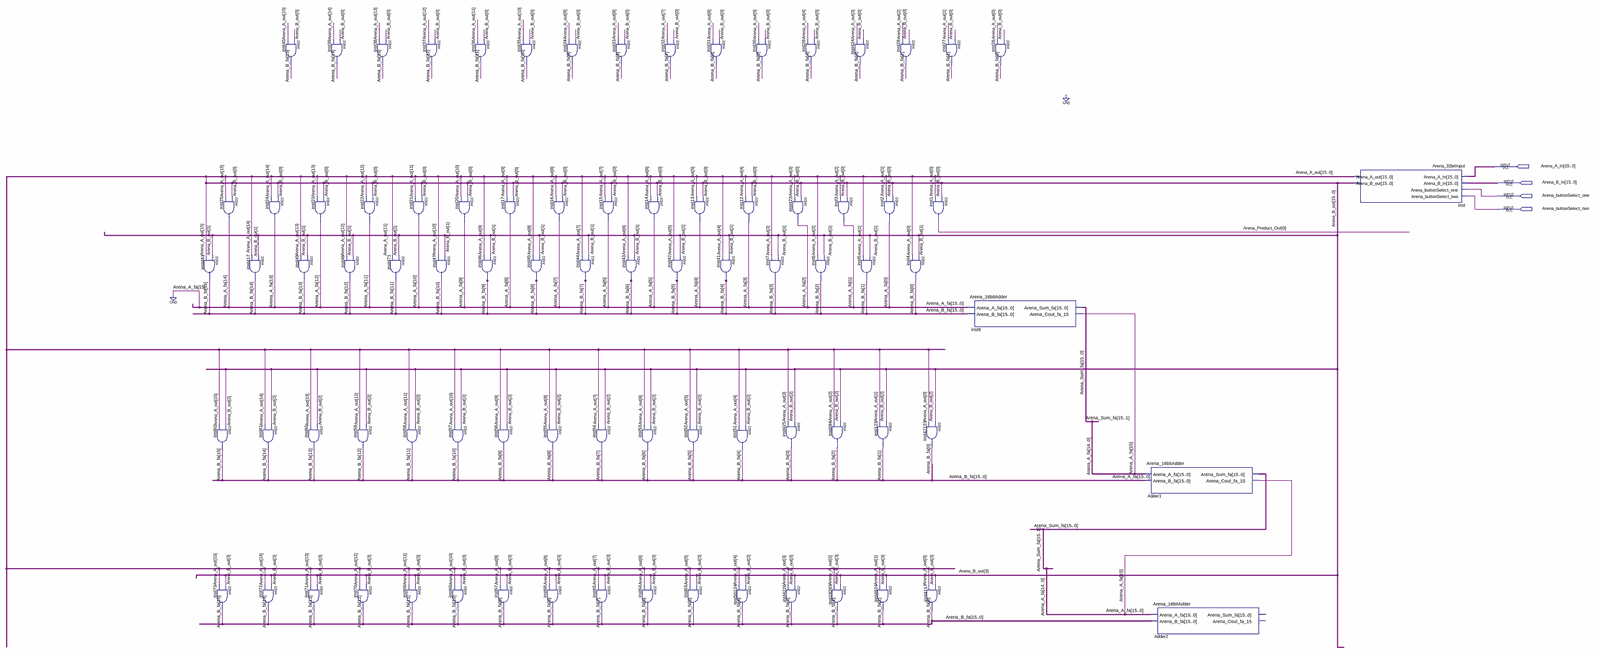
[diagram p0: schematic sheet, whole]
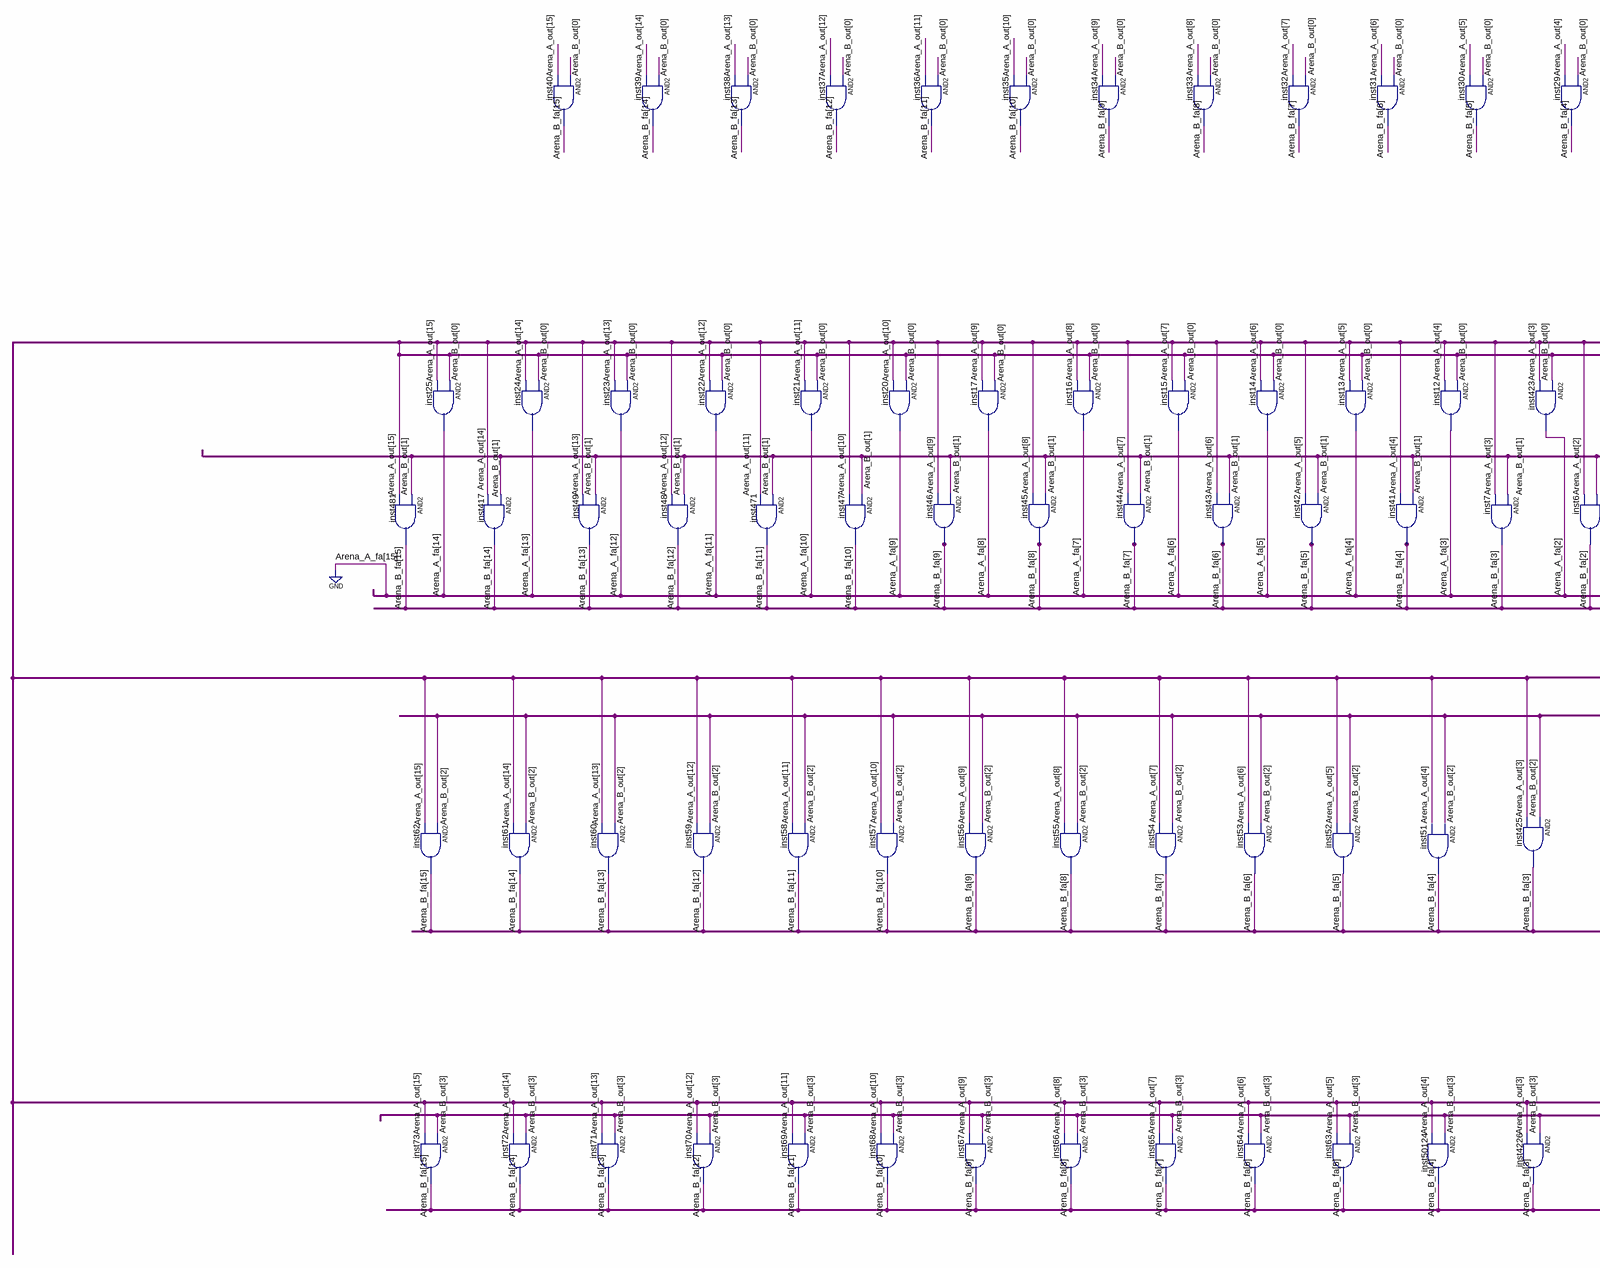
[diagram p1: schematic sheet, left part]
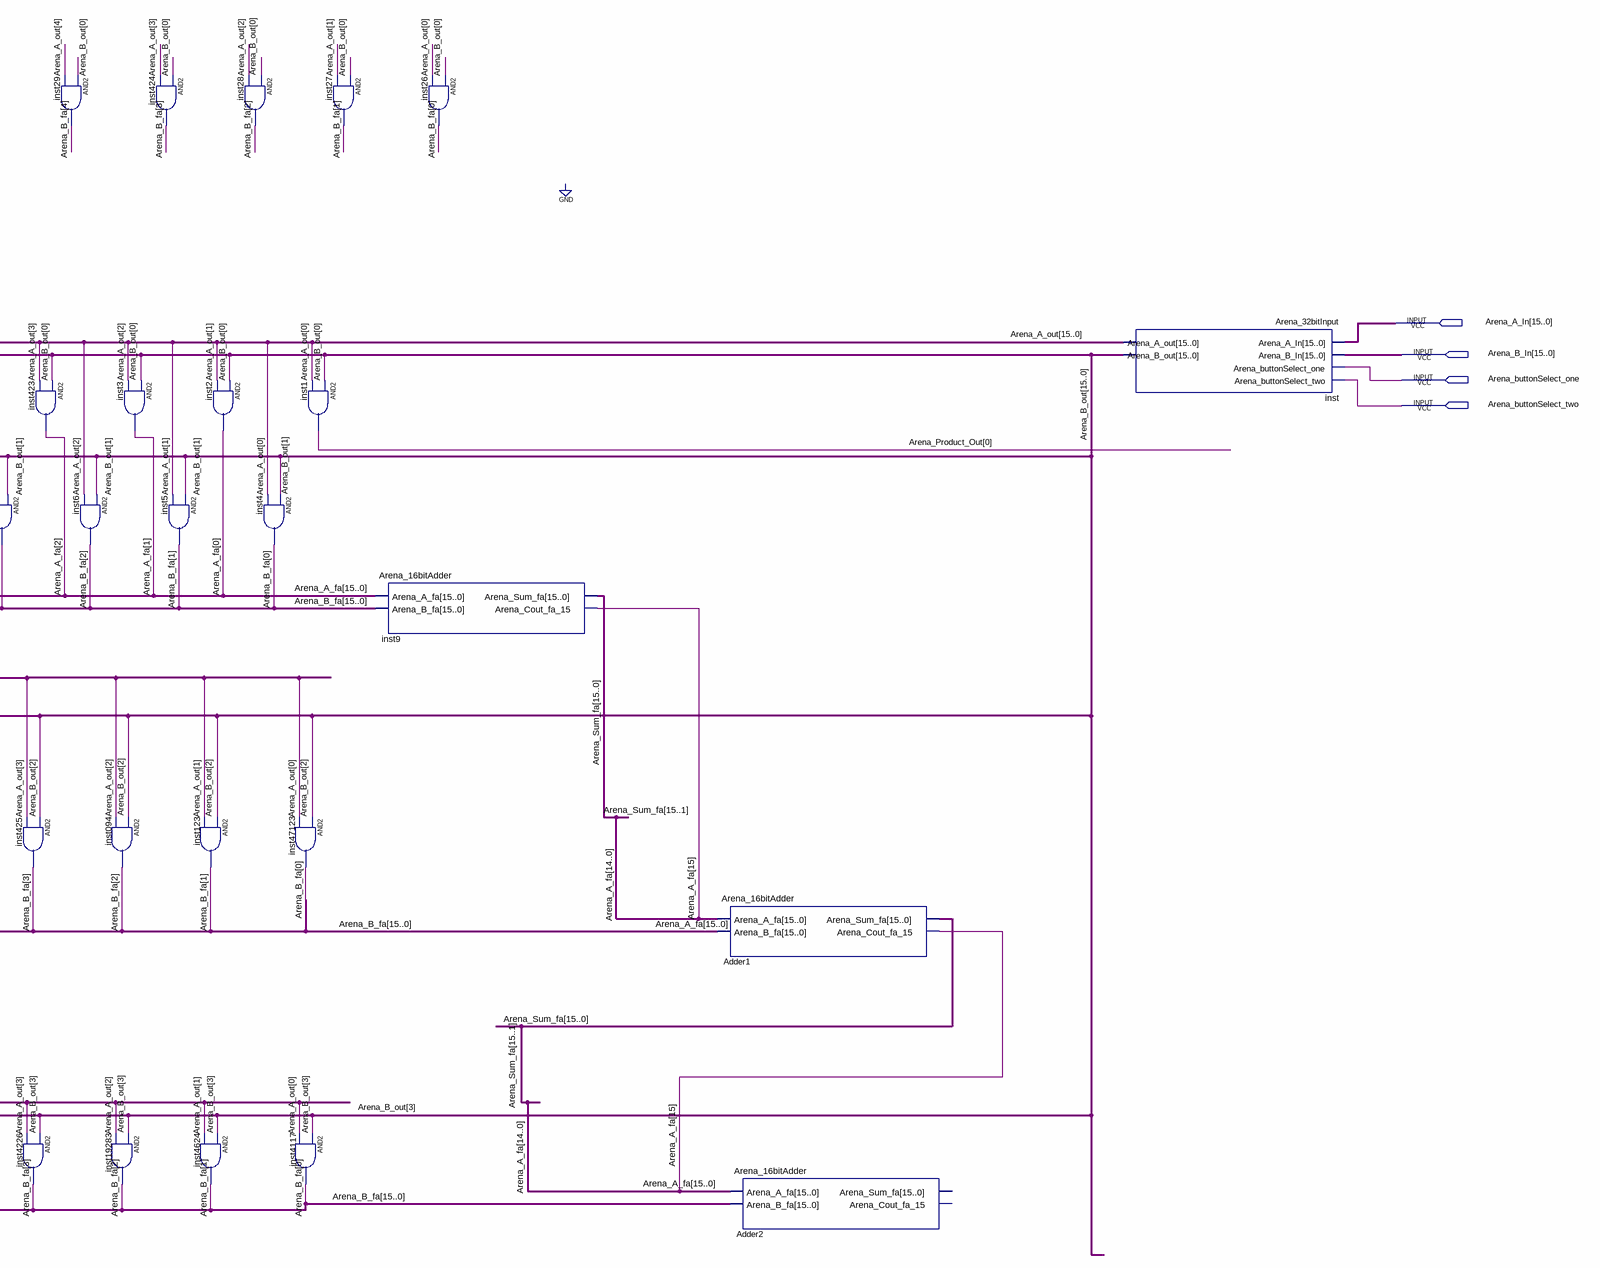
[diagram p2: schematic sheet, right part]
// Quartus schematic Arena_32bit_arrayMultiplier.bdf as structural Verilog: 84 symbols, 4 pins
module Arena_32bit_arrayMultiplier (
  input  [15:0] Arena_A_In,
  input  [15:0] Arena_B_In,
  input  Arena_buttonSelect_one,
  input  Arena_buttonSelect_two
);

  wire [0:0] Arena_Product_Out;
  wire [15:0] Arena_A_fa, Arena_A_out, Arena_B_fa, Arena_B_out, Arena_Sum_fa;

  and inst481 (Arena_B_fa[15], Arena_B_out[1], Arena_A_out[15]);
  and inst25 (Arena_A_fa[14], Arena_B_out[0], Arena_A_out[15]);
  and inst62 (Arena_B_fa[15], Arena_B_out[2], Arena_A_out[15]);
  and inst73 (Arena_B_fa[15], Arena_B_out[3], Arena_A_out[15]);
  and inst417 (Arena_B_fa[14], Arena_B_out[1], Arena_A_out[14]);
  and inst40 (Arena_B_fa[15], Arena_B_out[0], Arena_A_out[15]);
  and inst24 (Arena_A_fa[13], Arena_B_out[0], Arena_A_out[14]);
  and inst61 (Arena_B_fa[14], Arena_B_out[2], Arena_A_out[14]);
  and inst72 (Arena_B_fa[14], Arena_B_out[3], Arena_A_out[14]);
  and inst49 (Arena_B_fa[13], Arena_B_out[1], Arena_A_out[13]);
  and inst60 (Arena_B_fa[13], Arena_B_out[2], Arena_A_out[13]);
  and inst71 (Arena_B_fa[13], Arena_B_out[3], Arena_A_out[13]);
  and inst39 (Arena_B_fa[14], Arena_B_out[0], Arena_A_out[14]);
  and inst23 (Arena_A_fa[12], Arena_B_out[0], Arena_A_out[13]);
  and inst22 (Arena_A_fa[11], Arena_B_out[0], Arena_A_out[12]);
  and inst48 (Arena_B_fa[12], Arena_B_out[1], Arena_A_out[12]);
  and inst59 (Arena_B_fa[12], Arena_B_out[2], Arena_A_out[12]);
  and inst70 (Arena_B_fa[12], Arena_B_out[3], Arena_A_out[12]);
  and inst38 (Arena_B_fa[13], Arena_B_out[0], Arena_A_out[13]);
  and inst471 (Arena_B_fa[11], Arena_B_out[1], Arena_A_out[11]);
  and inst21 (Arena_A_fa[10], Arena_B_out[0], Arena_A_out[11]);
  and inst58 (Arena_B_fa[11], Arena_B_out[2], Arena_A_out[11]);
  and inst69 (Arena_B_fa[11], Arena_B_out[3], Arena_A_out[11]);
  and inst37 (Arena_B_fa[12], Arena_B_out[0], Arena_A_out[12]);
  and inst47 (Arena_B_fa[10], Arena_B_out[1], Arena_A_out[10]);
  and inst20 (Arena_A_fa[9], Arena_B_out[0], Arena_A_out[10]);
  and inst57 (Arena_B_fa[10], Arena_B_out[2], Arena_A_out[10]);
  and inst68 (Arena_B_fa[10], Arena_B_out[3], Arena_A_out[10]);
  and inst36 (Arena_B_fa[11], Arena_B_out[0], Arena_A_out[11]);
  and inst46 (Arena_B_fa[9], Arena_B_out[1], Arena_A_out[9]);
  and inst35 (Arena_B_fa[10], Arena_B_out[0], Arena_A_out[10]);
  and inst17 (Arena_A_fa[8], Arena_B_out[0], Arena_A_out[9]);
  and inst56 (Arena_B_fa[9], Arena_B_out[2], Arena_A_out[9]);
  and inst67 (Arena_B_fa[9], Arena_B_out[3], Arena_A_out[9]);
  and inst45 (Arena_B_fa[8], Arena_B_out[1], Arena_A_out[8]);
  and inst55 (Arena_B_fa[8], Arena_B_out[2], Arena_A_out[8]);
  and inst66 (Arena_B_fa[8], Arena_B_out[3], Arena_A_out[8]);
  and inst34 (Arena_B_fa[9], Arena_B_out[0], Arena_A_out[9]);
  and inst16 (Arena_A_fa[7], Arena_B_out[0], Arena_A_out[8]);
  and inst44 (Arena_B_fa[7], Arena_B_out[1], Arena_A_out[7]);
  and inst54 (Arena_B_fa[7], Arena_B_out[2], Arena_A_out[7]);
  and inst65 (Arena_B_fa[7], Arena_B_out[3], Arena_A_out[7]);
  and inst33 (Arena_B_fa[8], Arena_B_out[0], Arena_A_out[8]);
  and inst15 (Arena_A_fa[6], Arena_B_out[0], Arena_A_out[7]);
  and inst43 (Arena_B_fa[6], Arena_B_out[1], Arena_A_out[6]);
  and inst14 (Arena_A_fa[5], Arena_B_out[0], Arena_A_out[6]);
  and inst53 (Arena_B_fa[6], Arena_B_out[2], Arena_A_out[6]);
  and inst64 (Arena_B_fa[6], Arena_B_out[3], Arena_A_out[6]);
  and inst32 (Arena_B_fa[7], Arena_B_out[0], Arena_A_out[7]);
  and inst42 (Arena_B_fa[5], Arena_B_out[1], Arena_A_out[5]);
  and inst13 (Arena_A_fa[4], Arena_B_out[0], Arena_A_out[5]);
  and inst52 (Arena_B_fa[5], Arena_B_out[2], Arena_A_out[5]);
  and inst63 (Arena_B_fa[5], Arena_B_out[3], Arena_A_out[5]);
  and inst31 (Arena_B_fa[6], Arena_B_out[0], Arena_A_out[6]);
  and inst41 (Arena_B_fa[4], Arena_B_out[1], Arena_A_out[4]);
  and inst30 (Arena_B_fa[5], Arena_B_out[0], Arena_A_out[5]);
  and inst12 (Arena_A_fa[3], Arena_B_out[0], Arena_A_out[4]);
  // AND2 inst51 has open pins: IN1=open, IN2=open, OUT=Arena_B_fa[4]
  and inst50124 (Arena_B_fa[4], Arena_B_out[3], Arena_A_out[4]);
  and inst7 (Arena_B_fa[3], Arena_B_out[1], Arena_A_out[3]);
  and inst29 (Arena_B_fa[4], Arena_B_out[0], Arena_A_out[4]);
  and inst423 (Arena_A_fa[2], Arena_B_out[0], Arena_A_out[3]);
  and inst425 (Arena_B_fa[3], Arena_B_out[2], Arena_A_out[3]);
  and inst4226 (Arena_B_fa[3], Arena_B_out[3], Arena_A_out[3]);
  and inst6 (Arena_B_fa[2], Arena_B_out[1], Arena_A_out[2]);
  and inst094 (Arena_B_fa[2], Arena_B_out[2], Arena_A_out[2]);
  and inst19283 (Arena_B_fa[2], Arena_B_out[3], Arena_A_out[2]);
  and inst424 (Arena_B_fa[3], Arena_B_out[0], Arena_A_out[3]);
  and inst3 (Arena_A_fa[1], Arena_B_out[0], Arena_A_out[2]);
  and inst5 (Arena_B_fa[1], Arena_B_out[1], Arena_A_out[1]);
  and inst2 (Arena_A_fa[0], Arena_B_out[0], Arena_A_out[1]);
  and inst123 (Arena_B_fa[1], Arena_B_out[2], Arena_A_out[1]);
  and inst4624 (Arena_B_fa[1], Arena_B_out[3], Arena_A_out[1]);
  and inst28 (Arena_B_fa[2], Arena_B_out[0], Arena_A_out[2]);
  and inst4 (Arena_B_fa[0], Arena_B_out[1], Arena_A_out[0]);
  and inst1 (Arena_Product_Out[0], Arena_B_out[0], Arena_A_out[0]);
  and inst47123 (Arena_B_fa[0], Arena_B_out[2], Arena_A_out[0]);
  and inst4117 (Arena_B_fa[0], Arena_B_out[3], Arena_A_out[0]);
  and inst27 (Arena_B_fa[1], Arena_B_out[0], Arena_A_out[1]);
  Arena_16bitAdder inst9 (
    .Arena_A_fa(Arena_A_fa), .Arena_B_fa(Arena_B_fa), .Arena_Sum_fa(Arena_Sum_fa),
    .Arena_Cout_fa_15(Arena_A_fa[15]));
  and inst26 (Arena_B_fa[0], Arena_B_out[0], Arena_A_out[0]);
  Arena_16bitAdder Adder1 (
    .Arena_A_fa(Arena_A_fa), .Arena_B_fa(Arena_B_fa), .Arena_Sum_fa(Arena_Sum_fa),
    .Arena_Cout_fa_15(Arena_A_fa[15]));
  Arena_16bitAdder Adder2 (.Arena_A_fa(Arena_A_fa), .Arena_B_fa(Arena_B_fa));  // open: Arena_Sum_fa, Arena_Cout_fa_15
  Arena_32bitInput inst (
    .Arena_A_In(Arena_A_In), .Arena_B_In(Arena_B_In), .Arena_buttonSelect_one(Arena_buttonSelect_one),
    .Arena_buttonSelect_two(Arena_buttonSelect_two), .Arena_A_out(Arena_A_out), .Arena_B_out(Arena_B_out));
  // also tied to GND on the sheet: Arena_A_fa[15]
endmodule
